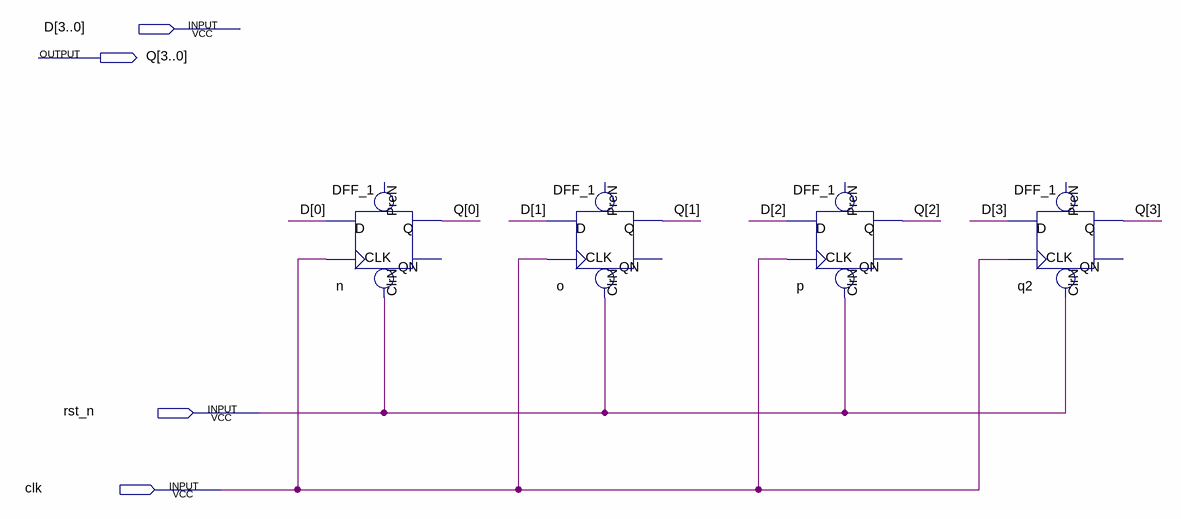
[diagram p0: schematic sheet]
// Quartus schematic FF4.bdf as structural Verilog: 4 symbols, 4 pins
module FF4 (
  input  [3:0] D,
  input  rst_n,
  input  clk,
  output [3:0] Q
);

  DFF_1 n (.CLK(clk), .D(D[0]), .ClrN(rst_n), .Q(Q[0]));  // open: PreN, QN
  DFF_1 o (.CLK(clk), .D(D[1]), .ClrN(rst_n), .Q(Q[1]));  // open: PreN, QN
  DFF_1 p (.CLK(clk), .D(D[2]), .ClrN(rst_n), .Q(Q[2]));  // open: PreN, QN
  DFF_1 q2 (.CLK(clk), .D(D[3]), .ClrN(rst_n), .Q(Q[3]));  // open: PreN, QN
endmodule
